# EAGLE design ardcore_smd (EAGLE 7.2.0)
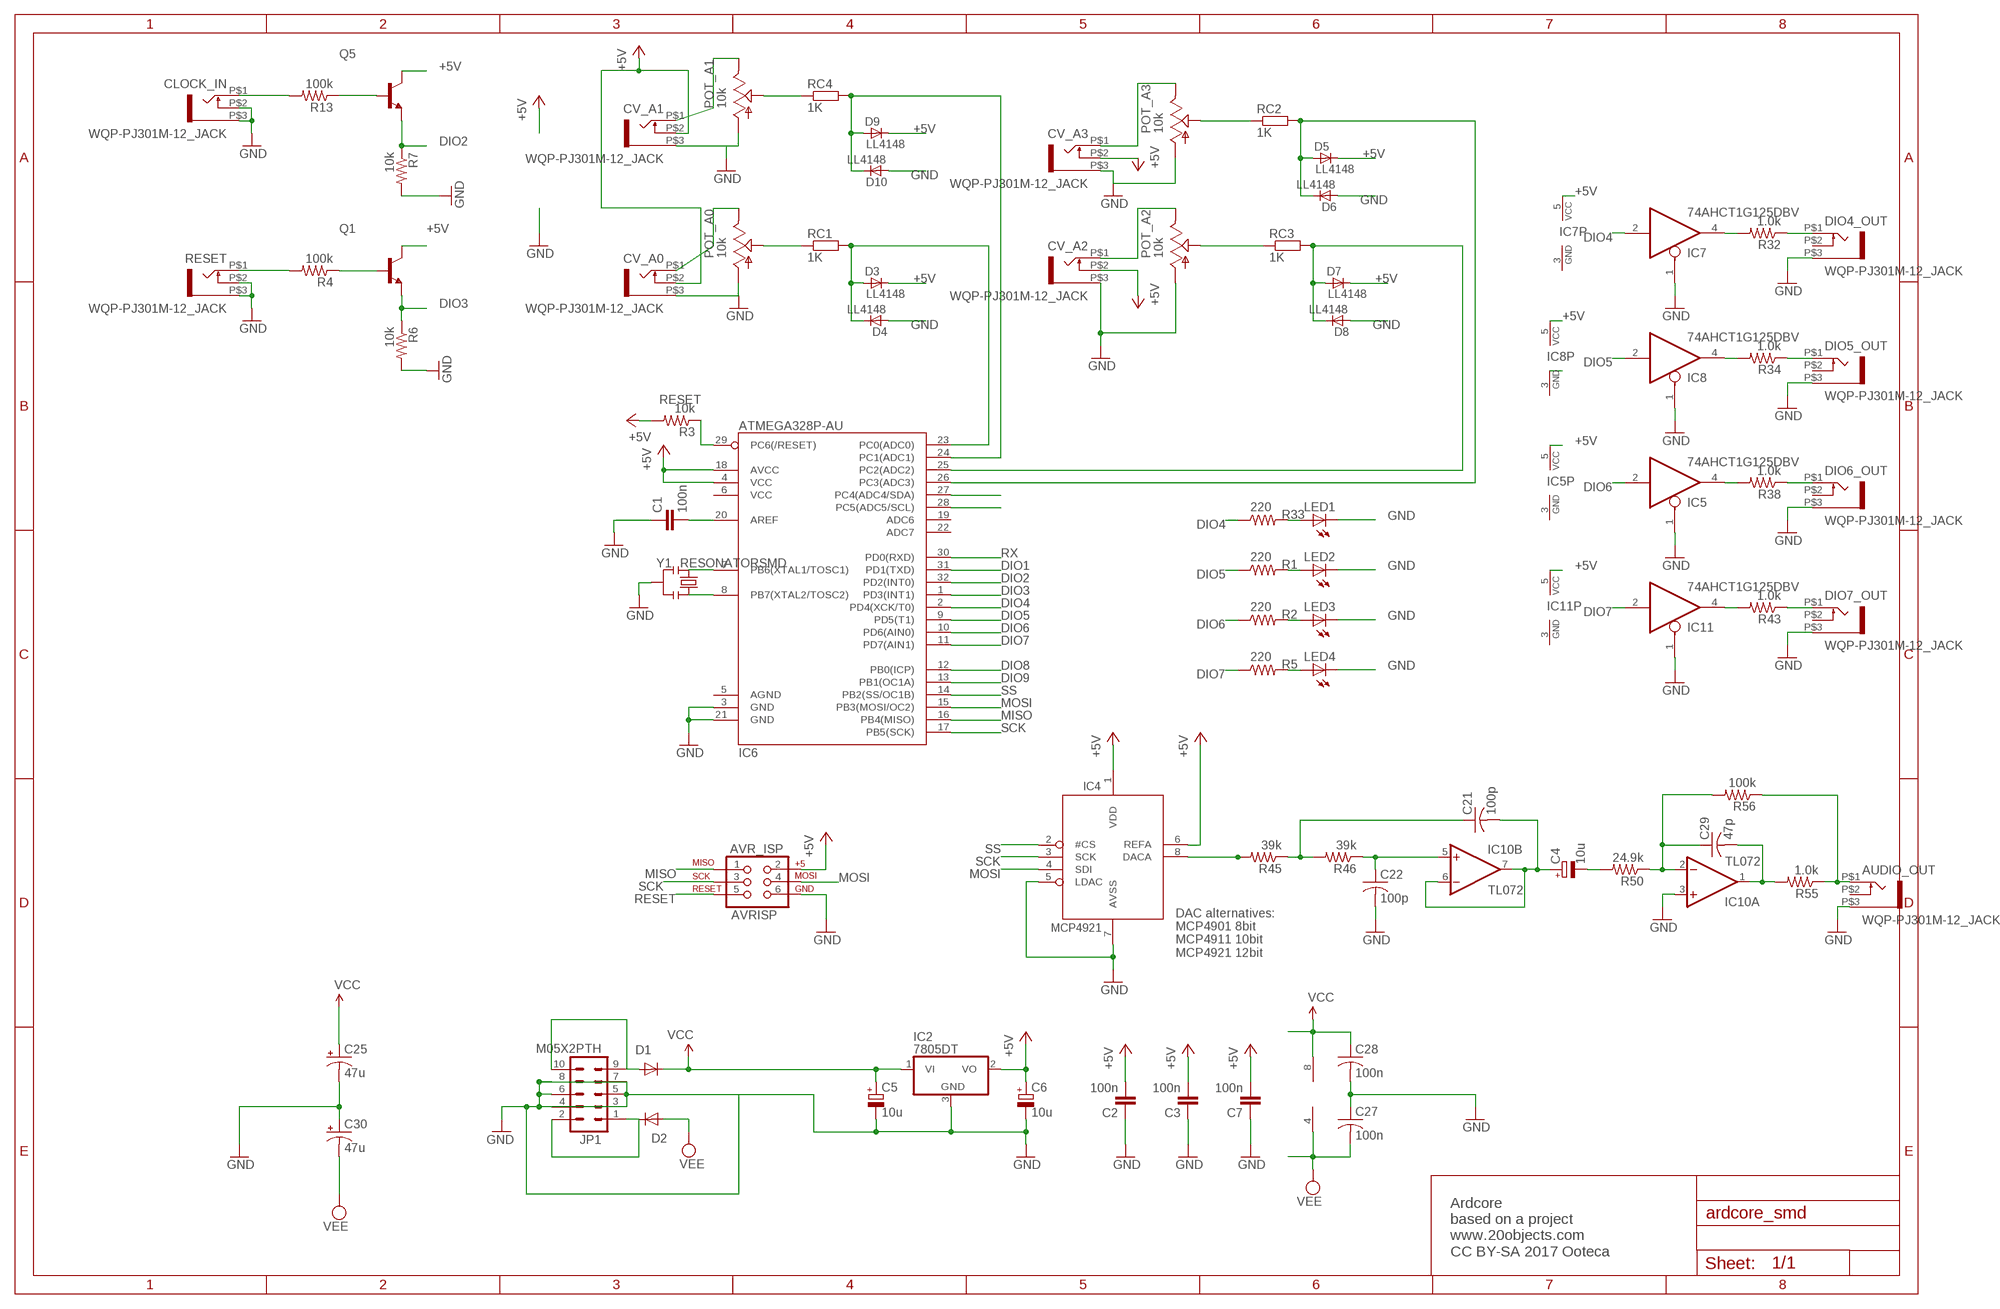
[diagram p0: schematic, sheet 1]

## Parts
AUDIO_OUT  WQP-PJ301M-12_JACK  [WQP-PJ301M-12_JACK]
AVR_ISP  AVRISP  AVR_SPI_PRG_6PTH  [2X3]
C1  100n  C-EUC0603  [C0603]
C2  100n  C-EUC0603  [C0603]
C3  100n  C-EUC0603  [C0603]
C4  10u  CPOL-EUE2.5-5  [E2,5-5]
C5  10u  CPOL-EUE2.5-5  [E2,5-5]
C6  10u  CPOL-EUE2.5-5  [E2,5-5]
C7  100n  C-EUC0805  [C0805]
C21  100p  C-USC0603  [C0603]
C22  100p  C-USC0603  [C0603]
C25  47u  CPOL-USD  [PANASONIC_D]
C27  100n  C-USC0603  [C0603]
C28  100n  C-USC0603  [C0603]
C29  47p  C-USC0603  [C0603]
C30  47u  CPOL-USD  [PANASONIC_D]
CLOCK_IN  WQP-PJ301M-12_JACK  [WQP-PJ301M-12_JACK]
CV_A0  WQP-PJ301M-12_JACK  [WQP-PJ301M-12_JACK]
CV_A1  WQP-PJ301M-12_JACK  [WQP-PJ301M-12_JACK]
CV_A2  WQP-PJ301M-12_JACK  [WQP-PJ301M-12_JACK]
CV_A3  WQP-PJ301M-12_JACK  [WQP-PJ301M-12_JACK]
D1  1N5819  DIODE-SOD123  [SOD123]
D2  1N5819  DIODE-SOD123  [SOD123]
D3  LL4148  [SOD80_DO213AA_MINIMELF]
D4  LL4148  [SOD80_DO213AA_MINIMELF]
D5  LL4148  [SOD80_DO213AA_MINIMELF]
D6  LL4148  [SOD80_DO213AA_MINIMELF]
D7  LL4148  [SOD80_DO213AA_MINIMELF]
D8  LL4148  [SOD80_DO213AA_MINIMELF]
D9  LL4148  [SOD80_DO213AA_MINIMELF]
D10  LL4148  [SOD80_DO213AA_MINIMELF]
DIO4_OUT  WQP-PJ301M-12_JACK  [WQP-PJ301M-12_JACK]
DIO5_OUT  WQP-PJ301M-12_JACK  [WQP-PJ301M-12_JACK]
DIO6_OUT  WQP-PJ301M-12_JACK  [WQP-PJ301M-12_JACK]
DIO7_OUT  WQP-PJ301M-12_JACK  [WQP-PJ301M-12_JACK]
IC2  7805DT  [TO252]
IC4  4921  MCP4921SO08  [SO08]
IC5  74AHCT1G125DBV  [SOT23-5]
IC6  ATMEGA328P-AU  ATMEGA168  [TQFP32-08]
IC7  74AHCT1G125DBV  [SOT23-5]
IC8  74AHCT1G125DBV  [SOT23-5]
IC10  TL072  TL072D  [SO08]
IC11  74AHCT1G125DBV  [SOT23-5]
JP1  M05X2PTH  [AVR_ICSP]
LED1  LED3MM  [LED3MM]
LED2  LED3MM  [LED3MM]
LED3  LED3MM  [LED3MM]
LED4  LED3MM  [LED3MM]
POT_A0  10k  POT_USVERTICAL  [ALPS_POT_VERTICAL]
POT_A1  10k  POT_USVERTICAL  [ALPS_POT_VERTICAL]
POT_A2  10k  POT_USVERTICAL  [ALPS_POT_VERTICAL]
POT_A3  10k  POT_USVERTICAL  [ALPS_POT_VERTICAL]
Q1  MMBT3904LT1-NPN-SOT23-BEC  [SOT23-BEC]
Q5  MMBT3904LT1-NPN-SOT23-BEC  [SOT23-BEC]
R1  220  R-US_R0603  [R0603]
R2  220  R-US_R0603  [R0603]
R3  10k  R-US_R0603  [R0603]
R4  100k  R-US_R0603  [R0603]
R5  220  R-US_R0603  [R0603]
R6  10k  R-US_R0603  [R0603]
R7  10k  R-US_R0603  [R0603]
R13  100k  R-US_R0603  [R0603]
R32  1.0k  R-US_R0603  [R0603]
R33  220  R-US_R0603  [R0603]
R34  1.0k  R-US_R0603  [R0603]
R38  1.0k  R-US_R0603  [R0603]
R43  1.0k  R-US_R0603  [R0603]
R45  39k  R-US_R0603  [R0603]
R46  39k  R-US_R0603  [R0603]
R50  24.9k  R-US_R0603  [R0603]
R55  1.0k  R-US_R0603  [R0603]
R56  100k  R-US_R0603  [R0603]
RC1  1K  R-EU_R0603  [R0603]
RC2  1K  R-EU_R0603  [R0603]
RC3  1K  R-EU_R0603  [R0603]
RC4  1K  R-EU_R0603  [R0603]
RESET  WQP-PJ301M-12_JACK  [WQP-PJ301M-12_JACK]
Y1  RESONATORSMD  [RESONATOR-SMD]

## Nets
+5V: AVR_ISP.2 C2.2 C3.2 C6.+ C7.2 CV_A0.P$2 CV_A1.P$2 CV_A2.P$2 CV_A3.P$2 D3.C D5.C D7.C D9.C IC2.2(VO) IC4.1(VDD) IC4.6(REFA) IC5.5(VCC) IC6.4(VCC) IC6.18(AVCC) IC7.5(VCC) IC8.5(VCC) IC11.5(VCC) Q1.C Q5.C R3.2
ANI1: D9.A D10.C IC6.24(PC1(ADC1)) RC4.2
ANI2: D3.A D4.C IC6.23(PC0(ADC0)) RC1.2
ANI3: D5.A D6.C IC6.26(PC3(ADC3)) RC2.2
ANI4: D7.A D8.C IC6.25(PC2(ADC2)) RC3.2
DIO1: IC6.31(PD1(TXD))
DIO2: IC6.32(PD2(INT0)) Q5.E R7.1
DIO3: IC6.1(PD3(INT1)) Q1.E R6.1
DIO4: IC6.2(PD4(XCK/T0)) IC7.2(I) R33.1
DIO5: IC6.9(PD5(T1)) IC8.2(I) R1.1
DIO6: IC5.2(I) IC6.10(PD6(AIN0)) R2.1
DIO7: IC6.11(PD7(AIN1)) IC11.2(I) R5.1
DIO8: IC6.12(PB0(ICP))
DIO9: IC6.13(PB1(OC1A))
GND: AUDIO_OUT.P$3 AVR_ISP.6 C1.1 C2.1 C3.1 C5.- C6.- C7.1 C22.2 C25.- C27.1 C28.2 C30.+ CLOCK_IN.P$2 CLOCK_IN.P$3 CV_A0.P$3 CV_A1.P$3 CV_A2.P$3 CV_A3.P$3 D4.A D6.A D8.A D10.A DIO4_OUT.P$3 DIO5_OUT.P$3 DIO6_OUT.P$3 DIO7_OUT.P$3 IC2.3(GND) IC4.5(LDAC) IC4.7(AVSS) IC5.1(OE) IC6.3(GND) IC6.21(GND) IC7.1(OE) IC8.1(OE) IC10.3(A:+IN) IC11.1(OE) JP1.3 JP1.4 JP1.5 JP1.6 JP1.7 JP1.8 LED1.K(C) LED2.K(C) LED3.K(C) LED4.K(C) POT_A0.P$3(A) POT_A1.P$3(A) POT_A2.P$3(A) POT_A3.P$3(A) R6.2 R7.2 RESET.P$2 RESET.P$3 Y1.2
MISO: AVR_ISP.1 IC6.16(PB4(MISO))
MOSI: AVR_ISP.4 IC4.4(SDI) IC6.15(PB3(MOSI/OC2))
N$2: IC4.8(DACA) R45.2
N$3: CV_A2.P$1 POT_A2.P$1(E)
N$5: D1.A JP1.9 JP1.10
N$6: D2.C JP1.1 JP1.2
N$7: DIO6_OUT.P$1 R38.1
N$8: C1.2 IC6.20(AREF)
N$9: DIO5_OUT.P$1 R34.1
N$10: DIO7_OUT.P$1 R43.1
N$11: DIO4_OUT.P$1 R32.1
N$12: CV_A3.P$1 POT_A3.P$1(E)
N$13: IC7.4(O) R32.2
N$14: Q1.B R4.1
N$15: R4.2 RESET.P$1
N$16: IC8.4(O) R34.2
N$17: Q5.B R13.1
N$18: IC6.7(PB6(XTAL1/TOSC1)) Y1.1
N$19: IC6.8(PB7(XTAL2/TOSC2)) Y1.3
N$20: LED2.A R1.2
N$21: LED3.A R2.2
N$22: CLOCK_IN.P$1 R13.2
N$23: LED4.A R5.2
N$25: CV_A0.P$1 POT_A0.P$1(E)
N$27: POT_A3.P$2(S) RC2.1
N$28: CV_A1.P$1 POT_A1.P$1(E)
N$29: POT_A2.P$2(S) RC3.1
N$30: POT_A0.P$2(S) RC1.1
N$31: POT_A1.P$2(S) RC4.1
N$45: IC5.4(O) R38.2
N$46: IC11.4(O) R43.2
N$54: LED1.A R33.2
N$67: C4.+ C21.2 IC10.6(B:-IN) IC10.7(B:OUT)
N$68: C4.- R50.2
N$69: C22.1 IC10.5(B:+IN) R46.1
N$71: C21.1 R45.1 R46.2
N$72: AUDIO_OUT.P$1 R55.1 R56.1
N$73: C29.2 IC10.1(A:OUT) R55.2
N$75: C29.1 IC10.2(A:-IN) R50.1 R56.2
RESET: AVR_ISP.5 IC6.29(PC6(/RESET)) R3.1
RX: IC6.30(PD0(RXD))
SCK: AVR_ISP.3 IC4.3(SCK) IC6.17(PB5(SCK))
SS: IC4.2(#CS) IC6.14(PB2(SS/OC1B))
SW_BLUE: IC6.28(PC5(ADC5/SCL))
SW_YELLOW: IC6.27(PC4(ADC4/SDA))
VCC: C5.+ C25.+ C28.1 D1.C IC2.1(VI) IC10.8(P:V+)
VEE: C27.2 C30.- D2.A IC10.4(P:V-)
Unconnected: AUDIO_OUT.P$2 DIO4_OUT.P$2 DIO5_OUT.P$2 DIO6_OUT.P$2 DIO7_OUT.P$2 IC6.5(AGND) IC6.6(VCC) IC6.19(ADC6) IC6.22(ADC7)

## Notes on the sheet
- DAC alternatives:
  MCP4901 8bit
  MCP4911 10bit
  MCP4921 12bit
- Ardcore
  based on a project
  www.20objects.com
  CC BY-SA 2017 Ooteca

## Power pins joined to a net without a drawn wire
GND: IC5.3(GND) IC7.3(GND) IC8.3(GND) IC11.3(GND)

## Library data of the parts
AUDIO_OUT CLOCK_IN CV_A0 CV_A1-CV_A3 DIO4_OUT DIO5_OUT DIO6_OUT DIO7_OUT RESET = thonkiconn:WQP-PJ301M-12_JACK
AVR_ISP = SparkFun:AVR_SPI_PRG_6: AVR ISP 6 Pin This is the reduced ISP connector for AVR programming. Common on Arduino. This footprint will take up less PCB space and can be used with a 10-pin to 6-pin adapter such as SKU: BOB-08508
C1-C3 C7 = rcl:C-EU: CAPACITOR, European symbol
C4-C6 = rcl:CPOL-EU: POLARIZED CAPACITOR, European symbol
C21 C22 C27-C29 = rcl:C-US: CAPACITOR, American symbol
C25 C30 = rcl:CPOL-US: POLARIZED CAPACITOR, American symbol
D1 D2 = diode:DIODE-: DIODE
D3-D10 = hhn_diodes_smd:LL4148: 1N4148 General Purpose Rectifie SMD-Version of 1N4148 Case: SOD 80 = DO 213 AA = MINIMELF (Glass) Author: Dipl.-Ing. FH Rainer Bayer HHN Hochschule Heilbronn, rainer.bayer@hs-heilbronn.de Ingenieurbüro ing-rb, mail@ing-rb.de
IC2 = linear:78*: Positive VOLTAGE REGULATOR Source: http://cache.national.com/ds/LM/LM78L05.pdf http://www.fairchildsemi.com/ds/LM/LM7805.pdf
IC4 = adafruit_mcp:MCP4921
IC5 IC7 IC8 IC11 = 74xx-little-us:74*1G125: Single Bus Buffer Gate with 3-State Output
IC6 = SparkFun:ATMEGA168
IC10 = linear:TL072: OP AMP
JP1 = og-header:M05X2: Header 5x2 Standard 10-pin dual row 0.1" header. Commonly used with AVR-ISP. Use with Spark Fun Electronics SKU: PRT-00778
LED1-LED4 = led:LED: LED OSRAM: - CHIPLED LG R971, LG N971, LY N971, LG Q971, LY Q971, LO R971, LY R971 LH N974, LH R974 LS Q976, LO Q976, LY Q976 LO Q996 - Hyper CHIPLED LW Q18S LB Q993, LB Q99A, LB R99A - SideLED LS A670, LO A670, LY A670, LG A670, LP A670 LB A673, LV A673, LT A673, LW A673 LH A674 LY A675 LS A676, LA A676, LO A676, LY A676, LW A676 LS A679, LY A679, LG A679 - Hyper Micro SIDELED® LS Y876, LA Y876, LO Y876, LY Y876 LT Y87S - SmartLED LW L88C, LW L88S LB L89C, LB L89S, LG L890 LS L89K, LO L89K, LY L89K LS L896, LA L896, LO L896, LY L896 - TOPLED LS T670, LO T670, LY T670, LG T670, LP T670 LSG T670, LSP T670, LSY T670, LOP T670, LYG T670 LG T671, LOG T671, LSG T671 LB T673, LV T673, LT T673, LW T673 LH T674 LS T676, LA T676, LO T676, LY T676, LB T676, LH T676, LSB T676, LW T676 LB T67C, LV T67C, LT T67C, LS T67K, LO T67K, LY T67K, LW E67C LS E67B, LA E67B, LO E67B, LY E67B, LB E67C, LV E67C, LT E67C LW T67C LS T679, LY T679, LG T679 LS T770, LO T770, LY T770, LG T770, LP T770 LB T773, LV T773, LT T773, LW T773 LH T774 LS E675, LA E675, LY E675, LS T675 LS T776, LA T776, LO T776, LY T776, LB T776 LHGB T686 LT T68C, LB T68C - Hyper Mini TOPLED® LB M676 - Mini TOPLED Santana® LG M470 LS M47K, LO M47K, LY M47K Source: http://www.osram.convergy.de LUXEON: - LUMILED® LXK2-PW12-R00, LXK2-PW12-S00, LXK2-PW14-U00, LXK2-PW14-V00 LXK2-PM12-R00, LXK2-PM12-S00, LXK2-PM14-U00 LXK2-PE12-Q00, LXK2-PE12-R00, LXK2-PE12-S00, LXK2-PE14-T00, LXK2-PE14-U00 LXK2-PB12-K00, LXK2-PB12-L00, LXK2-PB12-M00, LXK2-PB14-N00, LXK2-PB14-P00, LXK2-PB14-Q00 LXK2-PR12-L00, LXK2-PR12-M00, LXK2-PR14-Q00, LXK2-PR14-R00 LXK2-PD12-Q00, LXK2-PD12-R00, LXK2-PD12-S00 LXK2-PH12-R00, LXK2-PH12-S00 LXK2-PL12-P00, LXK2-PL12-Q00, LXK2-PL12-R00 Source: www.luxeon.com KINGBRIGHT: KA-3528ASYC Source: www.kingbright.com
POT_A0 POT_A1-POT_A3 = pot-alps:POT_US
Q1 Q5 = transistor:*-NPN-: NPN Transistror BF959 corrected 2008.03.06
R1-R7 R13 R32-R34 R38 R43 R45 R46 R50 R55 R56 = rcl:R-US_: RESISTOR, American symbol
RC1-RC4 = rcl:R-EU_: RESISTOR, European symbol
Y1 = SparkFun:RESONATOR: Resonator Small SMD resonator. This is the itty bitty 10/20MHz resonators with built in caps. CSTCE10M0G55 and CSTCE20M0V53. Footprint has been reviewed closely but hasn't been tested yet.

## Net classes
0 default: width 0.406 mm, drill 0.254 mm, clearance 0.254 mm
2 Power: width 0.61 mm, drill 0.508 mm, clearance 0.305 mm
3 GND: width 0.61 mm, drill 0.508 mm, clearance 0.305 mm

## Board
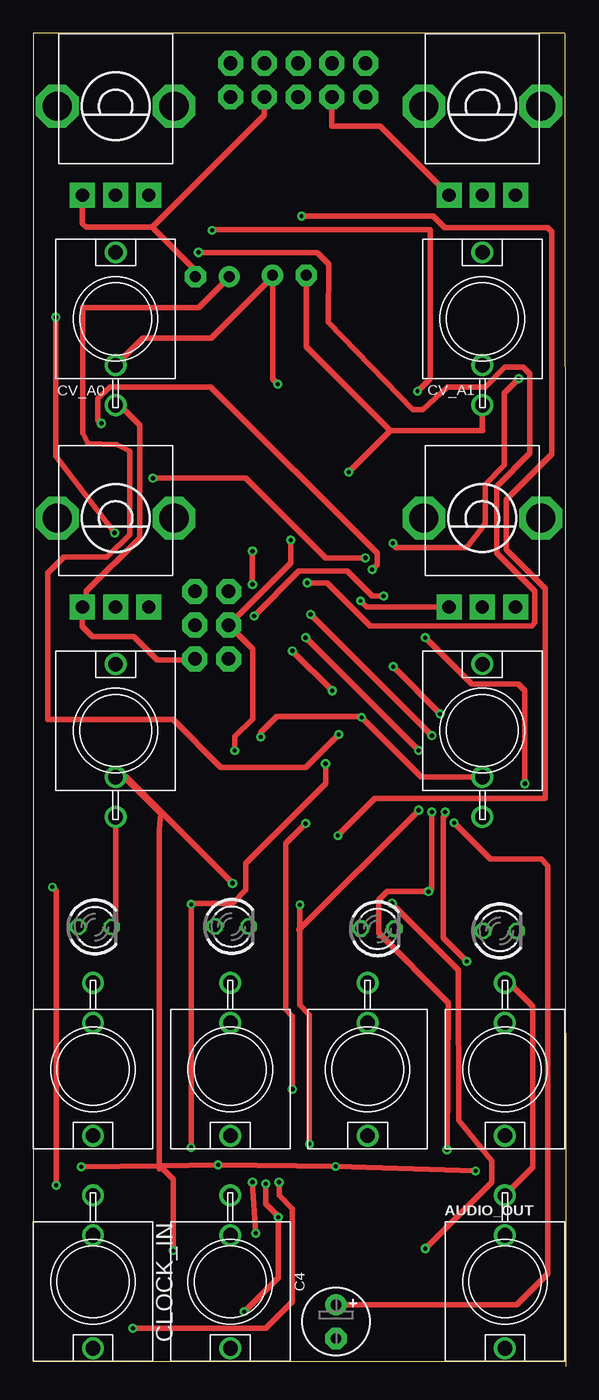
[diagram p1: board, top side]
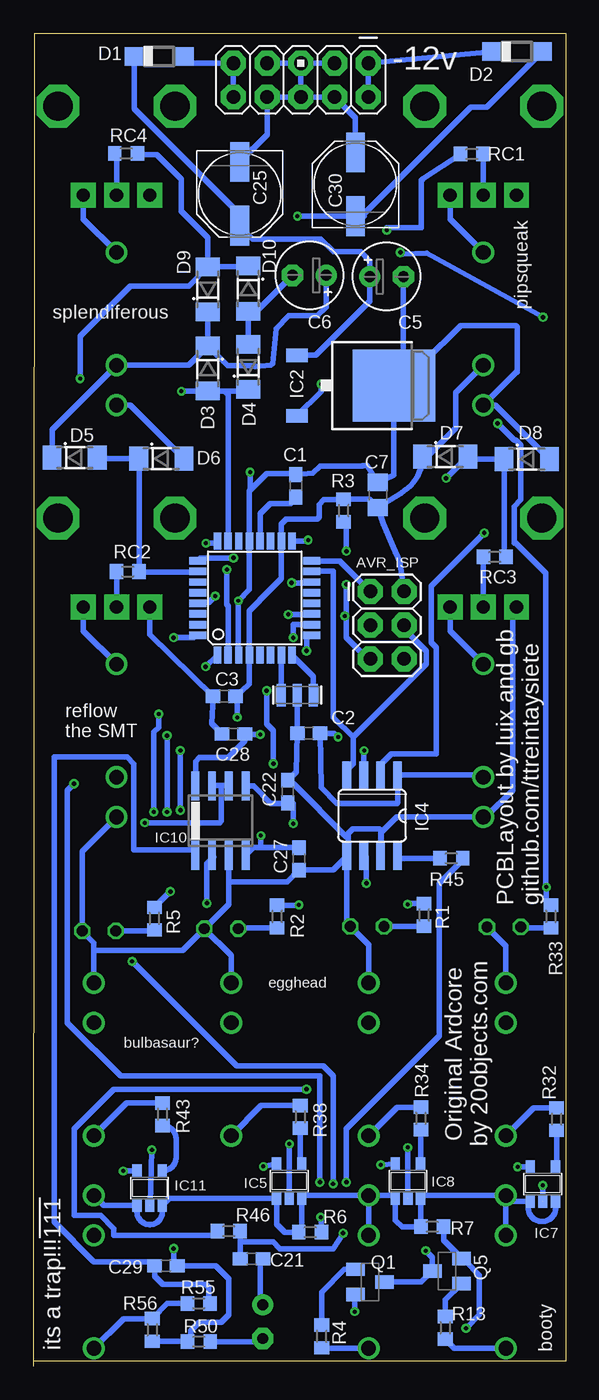
[diagram p2: board, bottom side, seen from below]

Size 40.07 x 100.36 mm. Coordinates in mm from the lower left corner, seen from the top.
Outline: 40,100.36 0,100.36 0,0.36 40,0.36
Outline: 39.99,100.33 40.07,0
Copper layers (1*16): Top 0.0356mm / dielectric 1.5011mm / Bottom 0.0356mm
Design rules "LaenPCBOrder *": minimum track width 6mil, minimum drill 13mil, track to track 6mil, track to pad 6mil, pad to pad 6mil, via to via 6mil, smd to smd 6mil, copper to edge 15mil, drill to drill 6mil, minimum pad ring 7mil, minimum via ring 7mil, stop-mask expansion 3mil, vias tented up to drill 31mil, thermal gap 10mil
Holes 3.2 mm at -14.8,31.12

### Footprints (pad centres in the part's own frame; a part is rotated, then mirrored left to right if it is on the bottom)
WQP-PJ301M-12_JACK = drill 1.1: P$1 0,5; P$2 0,-3.5; P$3 0,-6.5
2X3 = drill 1.016 pad 1.88 octagon: 1 0,0; 2 0,2.54; 3 2.54,0; 4 2.54,2.54; 5 5.08,0; 6 5.08,2.54
C0603 = smd 1.1 x 1: 1 -0.85,0; 2 0.85,0
E2,5-5 = drill 0.813 pad 1.6: + -1.27,0 | drill 0.813 pad 1.6 octagon: - 1.27,0
C0805 = smd 1.3 x 1.5: 1 -0.95,0; 2 0.95,0
PANASONIC_D = smd 3 x 1.4: + 2.4,0; - -2.4,0
SOD123 = smd 1.4 x 1.4: A 1.9,0; C -1.9,0
SOD80_DO213AA_MINIMELF = smd 1.4 x 1.8: A 1.7,0; C -1.7,0
TO252 = smd 1 x 1.6: 1 -2.28,-4.8; 2 2.28,-4.8 | smd 5.4 x 6.2: 3 0,2.5
SO08 = smd 0.66 x 2.032: 1 -1.905,-3.073; 2 -0.635,-3.073; 3 0.635,-3.073; 4 1.905,-3.073; 5 1.905,3.073; 6 0.635,3.073; 7 -0.635,3.073; 8 -1.905,3.073
SOT23-5 = smd 0.69 x 0.99: 1 -0.95,-1.29; 2 0,-1.29; 3 0.95,-1.29; 4 0.95,1.3; 5 -0.95,1.3
TQFP32-08 = smd 1.27 x 0.559: 1 -4.293,2.8; 2 -4.293,2; 3 -4.293,1.2; 4 -4.293,0.4; 5 -4.293,-0.4; 6 -4.293,-1.2; 7 -4.293,-2; 8 -4.293,-2.8; 17 4.293,-2.8; 18 4.293,-2; 19 4.293,-1.2; 20 4.293,-0.4; 21 4.293,0.4; 22 4.293,1.2; 23 4.293,2; 24 4.293,2.8 | smd 0.559 x 1.27: 9 -2.8,-4.293; 10 -2,-4.293; 11 -1.2,-4.293; 12 -0.4,-4.293; 13 0.4,-4.293; 14 1.2,-4.293; 15 2,-4.293; 16 2.8,-4.293; 25 2.8,4.293; 26 2,4.293; 27 1.2,4.293; 28 0.4,4.293; 29 -0.4,4.293; 30 -1.2,4.293; 31 -2,4.293; 32 -2.8,4.293
SO08' = smd 0.6 x 2.2: 1 -1.905,-2.6; 2 -0.635,-2.6; 3 0.635,-2.6; 4 1.905,-2.6; 5 1.905,2.6; 6 0.635,2.6; 7 -0.635,2.6; 8 -1.905,2.6
AVR_ICSP = drill 1.016 pad 1.88 octagon: 1 -1.27,5.08; 2 1.27,5.08; 3 -1.27,2.54; 4 1.27,2.54; 5 -1.27,0; 6 1.27,0; 7 -1.27,-2.54; 8 1.27,-2.54; 9 -1.27,-5.08; 10 1.27,-5.08
LED3MM = drill 0.813 octagon: A -1.27,0; K 1.27,0
ALPS_POT_VERTICAL = drill 1 pad 1.88 square: P$1 -2.5,6.7; P$2 0,6.7; P$3 2.5,6.7 | drill 2.2 pad 3.175 octagon: P$4 -4.4,0; P$5 4.4,0
SOT23-BEC = smd 1 x 1.4: B -0.95,-1.1; C 0,1.1; E 0.95,-1.1
R0603 = smd 1 x 1.1: 1 -0.85,0; 2 0.85,0
RESONATOR-SMD = smd 0.7 x 1.7: 1 -1.2,0; 2 0,0; 3 1.2,0

### Placement (x,y rotation side)
AUDIO_OUT  35.5,6.36 180 top
AVR_ISP  14.71,58.33 270 bottom
C1  20.3,66.28 270 bottom
C2  19.34,47.65 0 bottom
C3  25.68,50.44 0 bottom
C4  22.79,3.36 270 top
C5  13.47,82.04 0 bottom
C6  19.29,82.14 180 bottom
C7  14.13,65.59 270 bottom
C21  23.64,8.09 0 bottom
C22  20.91,43.26 90 bottom
C25  24.53,88.27 270 bottom
C27  20.07,38.2 90 bottom
C28  25,47.6 180 bottom
C29  30.08,7.57 180 bottom
C30  15.83,88.98 90 bottom
CLOCK_IN  4.5,6.36 180 top
CV_A0  6.2,78.86 0 top
CV_A1  33.8,78.86 0 top
CV_A2  6.2,47.86 0 top
CV_A3  33.8,47.86 0 top
D1  30.59,98.62 0 bottom
D2  3.66,98.97 0 bottom
D3  26.92,75.12 270 bottom
D4  23.89,75.24 90 bottom
D5  36.95,68.4 0 bottom
D6  30.43,68.34 0 bottom
D7  9.06,68.48 0 bottom
D8  2.93,68.29 0 bottom
D9  26.92,81.07 90 bottom
D10  23.88,81.13 270 bottom
DIO4_OUT  4.5,22.36 180 top
DIO5_OUT  14.83,22.36 180 top
DIO6_OUT  25.17,22.36 180 top
DIO7_OUT  35.5,22.36 180 top
IC2  15.43,73.83 270 bottom
IC4  14.56,41.45 180 bottom
IC5  20.81,13.94 0 bottom
IC6  23.4,57.84 90 bottom
IC7  1.72,13.71 0 bottom
IC8  11.87,13.95 0 bottom
IC10  TL072  [SO08']  25.98,41.08 0 bottom
IC11  31.31,13.42 0 bottom
JP1  19.93,96.83 270 bottom
LED1  4.65,33.07 0 top
LED2  14.94,33.11 0 top
LED3  25.92,32.94 0 top
LED4  35.12,32.78 0 top
POT_A0  6.2,94.86 180 top
POT_A1  33.8,94.86 180 top
POT_A2  6.2,63.86 180 top
POT_A3  33.8,63.86 180 top
Q1  14.72,6.35 270 bottom
Q5  8.93,7.17 90 bottom
R1  10.65,33.98 270 bottom
R2  21.71,33.86 270 bottom
R3  16.7,64.42 90 bottom
R4  18.36,2.25 270 bottom
R5  30.95,33.7 270 bottom
R6  19.23,10.1 180 bottom
R7  10.04,10.51 180 bottom
R13  9.06,2.9 270 bottom
R32  0.68,18.61 270 bottom
R33  1.11,33.86 270 bottom
R34  10.9,18.66 270 bottom
R38  19.97,18.78 270 bottom
R43  30.34,18.97 270 bottom
R45  8.6,38.25 180 bottom
R46  25.35,10.17 0 bottom
R50  27.6,1.86 0 bottom
R55  27.62,4.73 0 bottom
R56  31.11,2.74 270 bottom
RC1  7.06,91.26 180 bottom
RC2  32.95,59.83 0 bottom
RC3  5.34,60.94 0 bottom
RC4  33.08,91.32 0 bottom
RESET  14.83,6.36 180 top
Y1  20.2,50.53 0 bottom

### Tracks (layer width: path | path; a pad name or v marks a point on that pad's centre or on a via)
+5V  (via drill 0.3, 0.33)
  Top 0.406: v33.29,14.7 v22.75,15.04 v13.91,15.17 9.49,15.11 | 9.49,15.11 v3.62,15.02 | v10.53,8.71 10.53,14.07 9.62,14.98 | 9.62,14.98 9.49,15.11 | CV_A0.P$2 8.25,77.41 13.39,77.41 18.02,82.03 C6.+ 18.02,74.33 v18.41,73.94 | CV_A3.P$2 29.21,44.36 v24.71,48.86 24.65,48.92 18.32,48.92 17.13,47.73 v17.13,47.37 | v15,36.36 7,44.36 6.74,44.48 | 6.74,44.48 9.59,41.63 9.5,40.36 9.5,14.86 9.62,14.98 | 6.74,44.48 CV_A2.P$2
  Bottom 0.406: Q1.C 10.86,6.35 Q5.C 10.03,8.21 v10.53,8.71 | IC11.5 v33.29,14.7 | v3.62,15.02 IC7.5 | v13.91,15.17 IC8.5 | v22.75,15.04 IC5.5 | CV_A0.P$2 8.27,73.29 8.27,70.63 10.42,68.48 D7.C arc59 12.39,65.75 C7.2 | D9.C D3.C | D3.C 28.38,75.36 CV_A1.P$2 38.65,70.51 D5.C | AVR_ISP.2 12.47,60.59 12.98,61.68 13.72,63.44 C7.2 | C7.2 13.6,64.59 | C7.2 14.77,65.27 R3.2 16.73,65.25 18.19,65.25 18.55,64.89 18.55,63.95 18.7,63.8 21.01,63.8 21.4,63.41 IC6.18 21.4,59.3 23.02,57.68 23.02,57.64 23.8,56.86 IC6.4 23.8,51.38 C3.2 24.71,50.41 v24.71,48.86 | CV_A2.P$2 6.36,44.52 IC4.1 12.62,44.48 12.62,42.45 12.68,42.39 17.21,42.39 18.39,43.56 C2.2 17.41,47.65 v17.13,47.37 | IC2.2 18.41,73.37 v18.41,73.94 | D3.C 25.44,75.34 23.44,75.34 23.37,75.27 22.2,75.39 22.06,75.5 21.79,78.12 20.83,79.08 18.69,79.08 18.02,79.75 C6.+ | v15,36.36 15,38.36 IC4.6
ANI1  (via drill 0.3)
  Top 0.406: v36.54,74.36 35.45,73.27 35.45,67.84 34,66.39 34,63.44 32.63,61.62 27.28,61.62 v27.07,61.96
  Bottom 0.406: RC4.2 32.14,91.23 30.79,91.23 28.94,89.38 28.94,86.98 26.92,84.96 D9.A | D10.C 23.94,82.77 D9.A | D9.A 28.38,81.31 32.78,81.31 36.54,77.55 v36.54,74.36 | v27.07,61.96 26.37,61.96 IC6.24
ANI2  (via drill 0.3)
  Top 0.406: v13.46,85.52 13.5,85.56 29.88,85.56 29.88,74.36 v28.92,73.4
  Bottom 0.406: D4.C 24.01,73.42 25.65,73.42 | 25.65,73.42 D3.A 26.94,73.4 v28.92,73.4 | RC1.2 10.8,89.37 10.8,89.3 10.85,89.3 10.85,85.71 13.46,85.71 v13.46,85.52 | IC6.23 25.4,73.17 25.65,73.42
ANI3
  Bottom 0.406: D5.A 35.19,68.34 D6.C 32.09,68.3 32.09,59.8 | RC2.2 32.1,59.81 32.09,59.8 | 32.09,59.8 27.73,59.8 IC6.26
ANI4  (via drill 0.33)
  Top 0.406: v25,60.86 22,60.86 16,66.86 v9,66.86
  Bottom 0.406: RC3.2 4.63,61.08 D8.C 7.17,68.29 D7.A 7.5,68.36 v9,66.86 | v25,60.86 27.5,60.86 IC6.25
DIO2  (via drill 0.33)
  Top 0.406: v29.5,54.86 33,51.36 36.5,51.36 37,50.86 v37,43.86 | v18.5,13.86 18.5,12.86 19.5,11.86 19.5,4.86 17.5,2.86 v7.5,2.86
  Bottom 0.406: R7.1 9.19,9.48 Q5.E 7.5,7.86 6.5,6.86 6.5,3.86 v7.5,2.86 | v29.5,54.86 28,54.86 IC6.32 | v37,43.86 37.5,43.36 37.5,25.86 33.5,21.86 18.5,21.86 v18.5,13.86
DIO3  (via drill 0.3, 0.33)
  Top 0.406: v15.88,4.12 18.44,6.68 v18.44,11.23 18.38,11.36 17.5,12.23 v17.5,13.73 | v30.62,49.11 v27.09,52.67 | v31,41.73 31,41.48 30.88,41.36 30.88,32.23 v32.62,30.48
  Bottom 0.406: Q1.E 15.88,5.33 v15.88,4.12 | v18.44,11.23 18.38,11.17 R6.1 | v27.09,52.67 26.25,53.48 IC6.1 | v30.62,49.11 30.62,48.11 31,47.73 v31,41.73 | v32.62,30.48 24.75,22.61 18.25,22.61 17.5,21.86 v17.5,13.73
DIO4  (via drill 0.3, 0.33)
  Top 0.406: v1.45,36.08 1.73,35.8 v1.73,13.63 | v25.5,59.98 25.88,60.36 25.88,61.23 13.38,73.73 5.75,73.73 4.88,72.86 4.88,71.23 v5.12,70.98
  Bottom 0.406: R33.1 1.45,35.05 v1.45,36.08 1.5,36.23 1.5,59.73 3.75,61.98 3.88,61.98 3.88,64.73 3.38,65.23 3.38,69.36 3.75,69.73 3.88,69.73 v5.12,70.98 | v1.73,13.63 v1.72,13.62 IC7.2 | v25.5,59.98 25.5,57.36 25.38,57.23 25.38,53.61 IC6.2
DIO5  (via drill 0.3, 0.33)
  Top 0.406: v11.88,16.47 v11.88,34.78 12,34.86 15,34.86 16,35.86 16,37.86 22,43.86 v22,45.36 | v22.5,50.86 v19.5,53.86
  Bottom 0.406: IC8.2 v11.88,16.47 | v11.88,34.78 11.83,34.83 R1.1 | v19.5,53.86 19.5,54.86 IC6.9 | v22.5,50.86 22.5,48.36 22,47.86 v22,45.36
DIO6  (via drill 0.3, 0.33)
  Top 0.406: v20.79,16.73 20.79,26.47 20.07,27.19 20.07,32.86 | 20.07,32.86 v20.07,34.73 | v29,46.36 v20.5,54.86 | v29,41.86 20,32.86 20.07,32.86
  Bottom 0.406: IC5.2 20.79,12.67 v20.79,16.73 | v20.07,34.73 20.09,34.71 R2.1 | v20.5,54.86 20.5,55.86 19.5,55.86 IC6.10 | v29,41.86 v29,46.36
DIO7  (via drill 0.33)
  Top 0.406: v31.14,16.3 31.25,27.36 26,32.61 26,35.11 26.62,35.73 v29.75,35.73 30,35.98 v30,41.73 | v30,47.48 v20.88,56.61
  Bottom 0.406: v31.14,16.3 31.25,12.23 IC11.2 | v29.75,35.73 30.88,34.61 R5.1 | v20.88,56.61 19.12,56.61 IC6.11 | v30,41.73 v30,47.48
GND  (via drill 0.3)
  Top 0.406: POT_A0.P$3 3.7,86.04 3.99,85.75 8.97,85.75 | 8.97,85.75 12.21,82.52 C5.- | 8.97,85.75 17.39,94.17 JP1.4 | POT_A1.P$3 26.11,93.35 22.47,93.35 JP1.8 | v24.63,57.63 25.1,57.16 POT_A3.P$3 | LED1.K 6.2,33.35 CV_A2.P$3 | AUDIO_OUT.P$3 37.61,14.97 37.61,27.08 35.83,28.86 DIO7_OUT.P$3 | AVR_ISP.6 12.1,53.18 9.32,53.18 7.55,54.95 4.43,54.95 3.7,55.68 POT_A2.P$3 4,57.36 4,58.36 8,62.36 8,70.86 6.5,72.36 CV_A0.P$3 | v23.75,67.32 26.87,70.44 | 26.87,70.44 33.83,70.44 33.8,70.47 CV_A1.P$3 | 26.87,70.44 20.55,76.75 C6.-
  Bottom 0.406: AUDIO_OUT.P$3 34.77,12.13 IC11.1 32.26,11.64 arc-90 31.29,10.67 arc-90 30.36,11.6 IC11.3 29.84,12.65 IC5.1 21.76,10.7 21.13,10.07 20.11,10.07 R6.2 19.86,10.32 IC5.3 19.65,12.86 RESET.P$3 | CLOCK_IN.P$3 4.06,12.42 IC7.1 arc-211 0.76,11.94 IC7.3 | RESET.P$3 13.02,12.86 IC8.1 12.82,11 12.31,10.49 10.91,10.49 R7.2 10.92,10.54 IC8.3 10.72,12.86 CLOCK_IN.P$3 | RESET.P$2 RESET.P$3 | CLOCK_IN.P$2 CLOCK_IN.P$3 | JP1.5 JP1.6 | JP1.6 JP1.8 22.47,92.73 C25.- | JP1.5 JP1.7 | JP1.5 JP1.3 | JP1.6 JP1.4 15.83,94 C30.+ | 12.21,75.58 12.21,74.55 IC2.3 12.93,67.1 C7.1 14.91,67.81 15.28,67.81 15.31,67.78 18.47,67.78 19.02,67.23 C1.1 20.34,67.2 22.5,67.2 23.75,65.95 | 12.21,75.58 C5.- | D8.A 5.3,72.36 CV_A0.P$3 3.72,74.84 3.63,74.84 3.63,78.22 3.77,78.36 7.9,78.36 10.68,75.58 12.21,75.58 | D4.A D10.A 23.26,79.43 C6.- | CV_A1.P$3 32.75,72.36 D6.A | IC4.5 16.47,33.37 LED2.K 14.83,31.73 DIO5_OUT.P$3 | 16.38,39.86 16.38,40.12 16.03,40.47 14.03,40.47 13.93,40.37 IC4.7 13.86,38.45 13.86,40.2 12.7,41.36 CV_A2.P$3 6,41.36 4,43.36 4,56.86 POT_A2.P$3 | 16.38,39.86 16.38,38.47 IC4.5 | IC4.5 17.5,37.35 C27.1 20.97,36.45 25.34,36.45 | Y1.2 20.2,47.73 C2.1 20.29,44.73 C22.2 20.5,43.86 16.5,39.86 16.38,39.86 | C28.2 26.64,48.38 C3.1 31.3,55.1 POT_A3.P$3 | CV_A3.P$3 36.39,38.77 LED4.K 35.5,31.89 35.5,31.31 | 35.5,31.31 DIO7_OUT.P$3 | LED3.K 25.17,30.92 DIO6_OUT.P$3 | LED1.K 4.5,31.65 DIO4_OUT.P$3 | IC6.3 24.63,53.58 v24.63,57.63 23.8,58.46 IC6.21 23.8,65.9 23.75,65.95 | LED3.K 25.34,34.78 25.34,36.45 | 25.34,36.45 IC10.3 | LED3.K 28.82,31.31 35.5,31.31 | 23.75,65.95 v23.75,67.32
MISO
  Bottom 0.406: AVR_ISP.1 17.02,60.64 IC6.16
MOSI
  Bottom 0.406: 16,47.36 17.5,48.86 17.5,59.86 19,59.86 IC6.15 | 16,47.36 16,45.36 16.5,44.86 IC4.4 | 16,47.36 10.5,52.86 10.5,53.86 12,55.36 AVR_ISP.4
N$2
  Bottom 0.406: R45.2 12.53,38.25 IC4.8
N$3
  Bottom 0.406: CV_A2.P$1 8.7,55.36 POT_A2.P$1
N$5
  Bottom 0.406: JP1.10 JP1.9 28.17,98.1 D1.A
N$6
  Bottom 0.406: D2.C JP1.1 JP1.2
N$7
  Bottom 0.406: R38.1 22.9,19.63 DIO6_OUT.P$1
N$8
  Bottom 0.406: C1.2 20.68,64.96 22.24,64.96 23,64.2 IC6.20
N$9
  Bottom 0.406: R34.1 12.68,19.51 DIO5_OUT.P$1
N$10
  Bottom 0.406: R43.1 33.04,19.82 DIO7_OUT.P$1
N$11
  Bottom 0.406: R32.1 2.4,19.46 DIO4_OUT.P$1
N$12
  Bottom 0.406: CV_A3.P$1 36.3,55.36 POT_A3.P$1
N$13
  Bottom 0.406: IC7.4 0.68,15.1 R32.2
N$14
  Bottom 0.406: R4.1 18.36,5.59 16.66,7.29 Q1.B
N$15
  Bottom 0.406: RESET.P$1 18.32,1.36 R4.2
N$16
  Bottom 0.406: R34.2 10.9,15.27 IC8.4
N$17
  Bottom 0.406: Q5.B 9.06,4.99 R13.1
N$18
  Bottom 0.406: Y1.1 IC6.7
N$19
  Bottom 0.406: IC6.8 19,51.95 Y1.3
N$20
  Bottom 0.406: LED2.A 13.65,33.13 R1.2
N$21
  Bottom 0.406: LED3.A 24.58,33.01 R2.2
N$22
  Bottom 0.406: CLOCK_IN.P$1 8.37,1.36 R13.2
N$23
  Bottom 0.406: R5.2 31.02,32.78 LED4.A
N$25
  Bottom 0.406: CV_A0.P$1 8.7,86.36 POT_A0.P$1
N$27
  Bottom 0.406: RC2.1 POT_A3.P$2
N$28
  Bottom 0.406: CV_A1.P$1 36.3,86.36 POT_A1.P$1
N$29
  Bottom 0.406: POT_A2.P$2 RC3.1
N$30
  Bottom 0.406: POT_A0.P$2 RC1.1
N$31
  Bottom 0.406: POT_A1.P$2 33.8,91.19 RC4.1
N$45
  Bottom 0.406: R38.2 19.97,15.35 IC5.4
N$46
  Bottom 0.406: R43.2 arc90 29.31,17.09 29.31,15.77 arc90 IC11.4
N$54
  Bottom 0.406: LED1.A 3.32,33.01 R33.2
N$67  (via drill 0.3)
  Top 0.406: C4.+ 36.4,4.63 38.72,6.95 38.72,37.68 38.22,38.18 34.41,38.18 v31.67,40.92
  Bottom 0.406: IC10.7 26.45,43.68 26.42,43.71 26.05,43.71 | 26.05,43.71 25.38,43.71 IC10.6 | v31.67,40.92 26.04,40.92 25.92,41.04 25.92,43.58 26.05,43.71 | C21.2 23,7.86 23,4.86 C4.+
N$68
  Bottom 0.406: C4.- 23.02,1.86 R50.2
N$69  (via drill 0.33)
  Top 0.406: v19.5,20.86 19.5,26.36 19,26.86 19,39.36 v20.5,40.86
  Bottom 0.406: IC10.5 23.49,43.68 22.19,42.38 20.94,42.38 C22.1 20.5,42.36 v20.5,40.86 | v19.5,20.86 34,20.86 37,17.86 37,11.36 35,11.36 34,10.36 34,9.86 26.5,9.86 R46.1
N$71  (via drill 0.33)
  Top 0.406: v16.75,10.02 v16.5,13.86
  Bottom 0.406: C21.1 24.5,9.36 | 24.5,9.36 R46.2 | v16.5,13.86 16.5,17.86 9.5,24.86 9.5,36.36 8,37.86 R45.1 | v16.75,10.02 17.5,8.86 21.5,8.86 22,9.36 24.5,9.36
N$72
  Bottom 0.406: AUDIO_OUT.P$1 33.27,3.59 R56.1 29.97,4.73 R55.1
N$73
  Bottom 0.406: R55.2 26.87,4.83 26.87,5.96 27.08,6.17 30.33,6.17 30.93,6.77 C29.2 31,7.86 35.5,7.86 38.5,10.86 38.5,45.86 33,45.86 32.5,45.36 32.5,38.86 28,38.86 IC10.1
N$75  (via drill 0.33)
  Top 0.406: v27,34.86 32,29.86 32.03,18.5 34.5,15.45 34.5,13.86 v29.5,8.86
  Bottom 0.406: R56.2 28.48,1.89 R50.1 28.23,2.08 28.23,2.66 27.59,3.3 25.91,3.3 25.35,3.86 25.35,6.58 26.34,7.57 C29.1 29.5,7.86 v29.5,8.86 | v27,34.86 27,37.86 26.5,38.36 IC10.2
RESET  (via drill 0.33)
  Top 0.406: v16.5,58.86 v16.5,61.36 | v26.38,57.98 25.5,57.98 23.62,59.86 20,59.86 v16.62,56.48
  Bottom 0.406: v16.5,61.36 16.5,63.36 R3.1 | 16.5,56.48 16.5,54.86 15,53.36 AVR_ISP.5 | 16.5,56.48 v16.5,58.86 | v26.38,57.98 26.88,57.48 27.62,57.48 IC6.29 | v16.62,56.48 16.5,56.48
SCK  (via drill 0.3)
  Top 0.406: v19.38,62.21 19.38,60.46 AVR_ISP.3 16.51,53.98 16.51,48.75 15.17,47.41 v15.17,46.35
  Bottom 0.406: v19.38,62.21 19.46,62.13 IC6.17 | v15.17,46.35 15.2,46.32 IC4.3
SS  (via drill 0.33)
  Top 0.406: v20.62,58.98 22.12,58.98 25.38,55.73 37.5,55.73 37.75,55.98 37.75,58.36 34.88,61.23 34.88,66.23 37.38,68.73 37.38,74.73 36.88,75.23 35.5,75.23 34,73.73 31.14,73.73 29.33,72.01 28.58,72.01 22.18,78.61 22.25,82.98 21.38,83.86 v12.44,83.86 | v1.71,78.98 1.71,68.52 v6.12,62.73
  Bottom 0.406: v20.62,58.98 19.12,58.98 IC6.14 | v12.44,83.86 12.31,83.73 10.46,83.8 v1.71,78.98 | v6.12,62.73 10.12,58.73 10.12,54.48 9.75,54.11 9.75,46.11 13.12,46.11 13.88,45.36 13.88,44.61 IC4.2
VCC  (via drill 0.3)
  Top 0.406: v22.99,47.57 20.52,45.1 14.13,45.1 10.55,48.68 1.09,48.68 1.11,48.7 1.11,59.73 2.29,60.91 5.55,60.91 7.26,62.62 7.26,68.91 6.29,69.38 4.16,69.45 3.72,70.24 3.72,79.75 3.76,79.71 12.46,79.71 14.74,82 C5.+
  Bottom 0.406: D1.C 32.45,98.58 32.45,94.66 24.53,86.74 C25.+ 23.53,84.87 18.42,84.87 17.45,83.9 15.43,83.9 14.74,83.22 C5.+ 14.75,80.17 18.8,76.11 IC2.1 | v22.99,47.57 24.12,47.57 C28.1 24.15,47.06 25.39,45.82 27.57,45.82 27.84,45.55 27.84,43.73 IC10.8
VEE  (via drill 0.3)
  Top 0.406: v20.19,86.59 30.1,86.59 30.97,85.72 38.72,85.72 39.03,85.41 39.03,68.68 35.6,65.25 35.6,61.47 38.52,58.55 38.52,42.78 38.48,42.74 25.72,42.74 v22.93,39.95
  Bottom 0.406: 15.17,86.58 C30.- | C27.2 22.88,39.05 | 22.88,39.05 23.5,39.05 IC10.4 | C30.- 16.34,86.58 v20.18,86.58 v20.19,86.59 | v22.93,39.95 22.93,39.1 22.88,39.05 | D2.A 5.93,94.8 7.14,94.8 15.36,86.58 C30.-

### Text on the board
bNames: -12v | pipsqueak | splendiferous | reflow / the SMT | PCBLayout by luix and gb / github.com/ttreintaysiete | Original Ardcore / by 20objects.com | egghead | bulbasaur? | booty | its a trap!!!!111